# Altium schematic sheet fuelgauge.SchDoc
size A; SheetNumber: 4; SheetTotal: 4
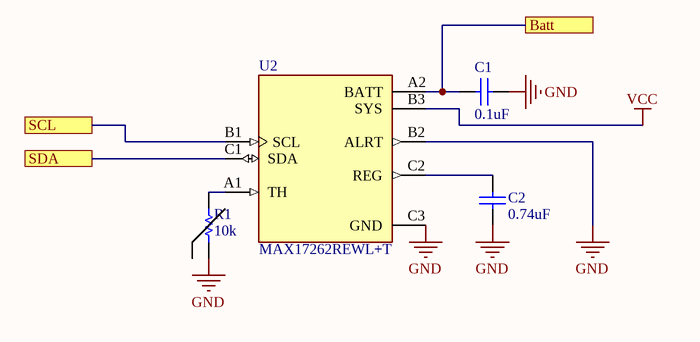
[diagram p0: fuelgauge.SchDoc]

## Parts
C1  value 0.1uF  (hidden comment: Capacitor)
C2  value 0.74uF  (hidden comment: Capacitor)
R1  value 10k  (hidden comment: Resistor)
U2  MAX17262REWL+T  [AD 9-WLP]

## Ports
Batt, SCL, SDA

## Nets
GND: C1.2 C2.1 R1.1 U2.B2(ALRT) U2.C3(GND)
VCC: U2.B3(SYS)
Batt: C1.1 U2.A2(BATT) ; port Batt
SCL: U2.B1(SCL) ; port SCL
SDA: U2.C1(SDA) ; port SDA
NetC2_2: C2.2 U2.C2(REG)
NetR1_2: R1.2 U2.A1(TH)

## Library data of the parts
C1 C2 = Capacitor: SimulationGenericComponent: True
R1 = Resistor: TC1: 0; SimulationGenericComponent: True; TC2: 0
U2 = MAX17262REWL+T: Battery Fuel Gauge IC LiFePO4/Li-ion 9-WLP (1.47x1.45)